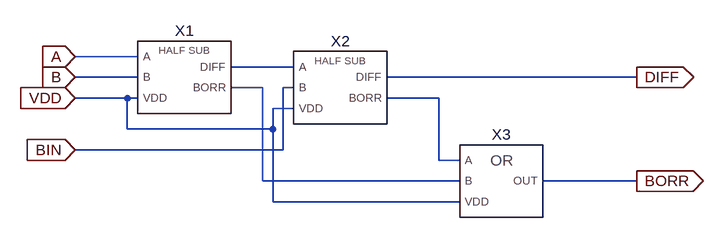
[diagram p0: schematic FullSubCMOS.asc]
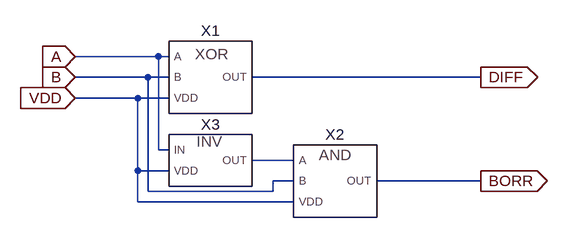
[diagram p1: sub-circuit halfsubcmos.asc]
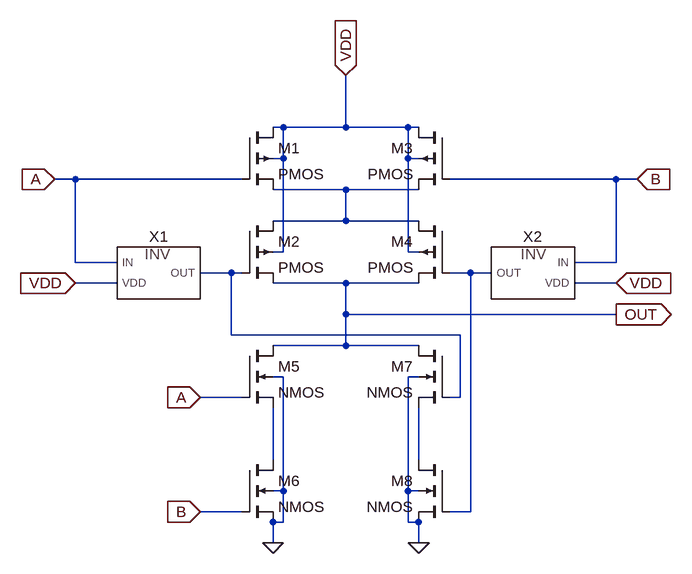
[diagram p2: sub-circuit xorcmos.asc]
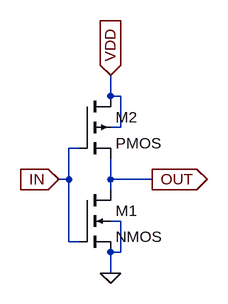
[diagram p3: sub-circuit invcmos.asc]
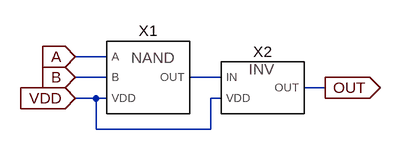
[diagram p4: sub-circuit andcmos.asc]
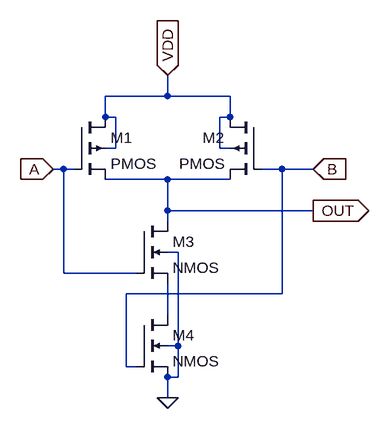
[diagram p5: sub-circuit nandcmos.asc]
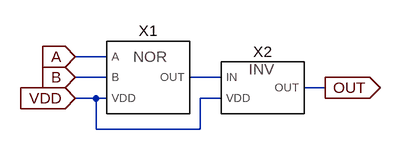
[diagram p6: sub-circuit orcmos.asc]
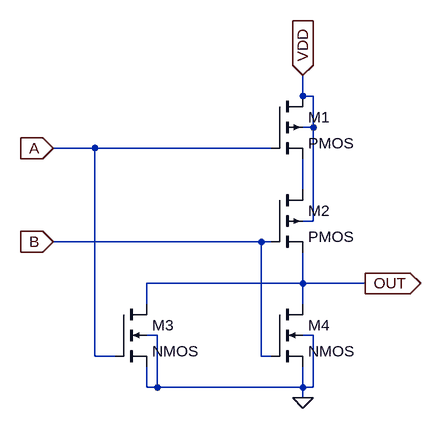
[diagram p7: sub-circuit norcmos.asc]
FullSubCMOS.asc, the LTspice schematic file:
Version 4
SHEET 1 1008 680
WIRE 112 112 16 112
WIRE 352 128 256 128
WIRE 112 144 16 144
WIRE 880 144 496 144
WIRE 304 160 256 160
WIRE 352 160 336 160
WIRE 96 176 16 176
WIRE 112 176 96 176
WIRE 576 176 496 176
WIRE 352 192 320 192
WIRE 96 224 96 176
WIRE 320 224 320 192
WIRE 320 224 96 224
WIRE 336 256 336 160
WIRE 336 256 16 256
WIRE 576 272 576 176
WIRE 608 272 576 272
WIRE 304 304 304 160
WIRE 608 304 304 304
WIRE 880 304 736 304
WIRE 320 336 320 224
WIRE 608 336 320 336
FLAG 16 112 A
IOPIN 16 112 In
FLAG 16 144 B
IOPIN 16 144 In
FLAG 16 176 VDD
IOPIN 16 176 In
FLAG 880 144 DIFF
IOPIN 880 144 Out
FLAG 880 304 BORR
IOPIN 880 304 Out
FLAG 16 256 BIN
IOPIN 16 256 In
SYMBOL HalfSubCMOS 176 144 R0
SYMATTR InstName X1
SYMBOL HalfSubCMOS 416 160 R0
SYMATTR InstName X2
SYMBOL OrCMOS 672 304 R0
SYMATTR InstName X3

halfsubcmos.asc, the sub-circuit schematic file:
Version 4
SHEET 1 880 680
WIRE 144 80 16 80
WIRE 160 80 144 80
WIRE 128 112 16 112
WIRE 160 112 128 112
WIRE 640 112 288 112
WIRE 112 144 16 144
WIRE 160 144 112 144
WIRE 144 224 144 80
WIRE 160 224 144 224
WIRE 352 240 288 240
WIRE 112 256 112 144
WIRE 160 256 112 256
WIRE 352 272 320 272
WIRE 640 272 480 272
WIRE 128 288 128 112
WIRE 320 288 320 272
WIRE 320 288 128 288
WIRE 112 304 112 256
WIRE 352 304 112 304
FLAG 16 80 A
IOPIN 16 80 In
FLAG 16 112 B
IOPIN 16 112 In
FLAG 16 144 VDD
IOPIN 16 144 In
FLAG 640 112 DIFF
IOPIN 640 112 Out
FLAG 640 272 BORR
IOPIN 640 272 Out
SYMBOL XorCMOS 224 112 R0
SYMATTR InstName X1
SYMBOL AndCMOS 416 272 R0
SYMATTR InstName X2
SYMBOL InvCMOS 224 240 R0
SYMATTR InstName X3

xorcmos.asc, the sub-circuit schematic file:
Version 4
SHEET 1 880 720
WIRE 160 32 144 32
WIRE 256 32 256 -48
WIRE 256 32 160 32
WIRE 352 32 256 32
WIRE 368 32 352 32
WIRE 160 80 160 32
WIRE 160 80 144 80
WIRE 352 80 352 32
WIRE 368 80 352 80
WIRE -160 112 -192 112
WIRE 96 112 -160 112
WIRE 672 112 416 112
WIRE 704 112 672 112
WIRE 256 128 144 128
WIRE 368 128 256 128
WIRE 256 176 256 128
WIRE 256 176 144 176
WIRE 368 176 256 176
WIRE 160 224 160 80
WIRE 160 224 144 224
WIRE 352 224 352 80
WIRE 368 224 352 224
WIRE -160 240 -160 112
WIRE -96 240 -160 240
WIRE 672 240 672 112
WIRE 672 240 608 240
WIRE 80 256 32 256
WIRE 96 256 80 256
WIRE 448 256 416 256
WIRE 480 256 448 256
WIRE -96 272 -160 272
WIRE 256 272 144 272
WIRE 368 272 256 272
WIRE 672 272 608 272
WIRE 256 320 256 272
WIRE 672 320 256 320
WIRE 80 352 80 256
WIRE 432 352 80 352
WIRE 256 368 256 320
WIRE 256 368 144 368
WIRE 368 368 256 368
WIRE 160 416 144 416
WIRE 368 416 352 416
WIRE 96 448 32 448
WIRE 432 448 432 352
WIRE 432 448 416 448
WIRE 144 544 144 464
WIRE 368 544 368 464
WIRE 160 592 160 416
WIRE 160 592 144 592
WIRE 352 592 352 416
WIRE 368 592 352 592
WIRE 96 624 32 624
WIRE 448 624 448 256
WIRE 448 624 416 624
WIRE 160 640 160 592
WIRE 160 640 144 640
WIRE 352 640 352 592
WIRE 368 640 352 640
WIRE 144 672 144 640
WIRE 368 672 368 640
FLAG 144 672 0
FLAG 368 672 0
FLAG -192 112 A
IOPIN -192 112 In
FLAG 704 112 B
IOPIN 704 112 In
FLAG 256 -48 VDD
IOPIN 256 -48 In
FLAG -160 272 VDD
IOPIN -160 272 In
FLAG 672 272 VDD
IOPIN 672 272 In
FLAG 32 448 A
IOPIN 32 448 In
FLAG 32 624 B
IOPIN 32 624 In
FLAG 672 320 OUT
IOPIN 672 320 Out
SYMBOL pmos4 96 32 R0
SYMATTR InstName M1
SYMATTR Value2 l=65nm w=162.5nm
SYMBOL pmos4 96 176 R0
SYMATTR InstName M2
SYMATTR Value2 l=65nm w=162.5nm
SYMBOL pmos4 416 32 M0
SYMATTR InstName M3
SYMATTR Value2 l=65nm w=162.5nm
SYMBOL pmos4 416 176 M0
SYMATTR InstName M4
SYMATTR Value2 l=65nm w=162.5nm
SYMBOL nmos4 96 368 R0
SYMATTR InstName M5
SYMATTR Value2 l=65nm w=65nm
SYMBOL nmos4 96 544 R0
SYMATTR InstName M6
SYMATTR Value2 l=65nm w=65nm
SYMBOL nmos4 416 368 M0
SYMATTR InstName M7
SYMATTR Value2 l=65nm w=65nm
SYMBOL nmos4 416 544 M0
SYMATTR InstName M8
SYMATTR Value2 l=65nm w=65nm
SYMBOL InvCMOS -32 256 R0
SYMATTR InstName X1
SYMBOL InvCMOS 544 256 M0
SYMATTR InstName X2

invcmos.asc, the sub-circuit schematic file:
Version 4
SHEET 1 880 680
WIRE 208 32 208 0
WIRE 224 32 208 32
WIRE 224 80 224 32
WIRE 224 80 208 80
WIRE 160 112 144 112
WIRE 144 160 144 112
WIRE 144 160 128 160
WIRE 208 160 208 128
WIRE 272 160 208 160
WIRE 208 176 208 160
WIRE 224 224 208 224
WIRE 144 256 144 160
WIRE 160 256 144 256
WIRE 224 272 224 224
WIRE 224 272 208 272
WIRE 208 304 208 272
FLAG 208 304 0
FLAG 208 0 VDD
IOPIN 208 0 In
FLAG 128 160 IN
IOPIN 128 160 In
FLAG 272 160 OUT
IOPIN 272 160 Out
SYMBOL nmos4 160 176 R0
SYMATTR InstName M1
SYMATTR Value2 l=65nm w=65nm
SYMBOL pmos4 160 32 R0
SYMATTR InstName M2
SYMATTR Value2 l=65nm w=162.5nm

andcmos.asc, the sub-circuit schematic file:
Version 4
SHEET 1 880 680
WIRE 112 112 64 112
WIRE 112 144 64 144
WIRE 288 144 240 144
WIRE 448 160 416 160
WIRE 96 176 64 176
WIRE 112 176 96 176
WIRE 288 176 272 176
WIRE 96 224 96 176
WIRE 272 224 272 176
WIRE 272 224 96 224
FLAG 64 112 A
IOPIN 64 112 In
FLAG 64 144 B
IOPIN 64 144 In
FLAG 64 176 VDD
IOPIN 64 176 In
FLAG 448 160 OUT
IOPIN 448 160 Out
SYMBOL NandCMOS 176 144 R0
SYMATTR InstName X1
SYMBOL InvCMOS 352 160 R0
SYMATTR InstName X2

nandcmos.asc, the sub-circuit schematic file:
Version 4
SHEET 1 880 680
WIRE -112 -160 -112 -192
WIRE -112 -160 -208 -160
WIRE -16 -160 -112 -160
WIRE -208 -128 -208 -160
WIRE -192 -128 -208 -128
WIRE -16 -128 -16 -160
WIRE -16 -128 -32 -128
WIRE -192 -80 -192 -128
WIRE -192 -80 -208 -80
WIRE -32 -80 -32 -128
WIRE -16 -80 -32 -80
WIRE -272 -48 -288 -48
WIRE -256 -48 -272 -48
WIRE 64 -48 32 -48
WIRE 112 -48 64 -48
WIRE -112 -32 -208 -32
WIRE -16 -32 -112 -32
WIRE -112 16 -112 -32
WIRE 112 16 -112 16
WIRE -112 32 -112 16
WIRE -96 80 -112 80
WIRE -272 112 -272 -48
WIRE -160 112 -272 112
WIRE 64 144 64 -48
WIRE 64 144 -176 144
WIRE -112 176 -112 128
WIRE -96 224 -96 80
WIRE -96 224 -112 224
WIRE -176 256 -176 144
WIRE -160 256 -176 256
WIRE -96 272 -96 224
WIRE -96 272 -112 272
WIRE -112 304 -112 272
FLAG -112 304 0
FLAG -112 -192 VDD
IOPIN -112 -192 In
FLAG -288 -48 A
IOPIN -288 -48 In
FLAG 112 -48 B
IOPIN 112 -48 In
FLAG 112 16 OUT
IOPIN 112 16 Out
SYMBOL pmos4 -256 -128 R0
SYMATTR InstName M1
SYMATTR Value2 l=65nm w=162.5nm
SYMBOL pmos4 32 -128 M0
SYMATTR InstName M2
SYMATTR Value2 l=65nm w=162.5nm
SYMBOL nmos4 -160 32 R0
SYMATTR InstName M3
SYMATTR Value2 l=65nm w=65nm
SYMBOL nmos4 -160 176 R0
SYMATTR InstName M4
SYMATTR Value2 l=65nm w=65nm

orcmos.asc, the sub-circuit schematic file:
Version 4
SHEET 1 880 680
WIRE 112 128 64 128
WIRE 112 160 64 160
WIRE 288 160 240 160
WIRE 448 176 416 176
WIRE 96 192 64 192
WIRE 112 192 96 192
WIRE 288 192 256 192
WIRE 96 240 96 192
WIRE 256 240 256 192
WIRE 256 240 96 240
FLAG 64 128 A
IOPIN 64 128 In
FLAG 64 160 B
IOPIN 64 160 In
FLAG 64 192 VDD
IOPIN 64 192 In
FLAG 448 176 OUT
IOPIN 448 176 Out
SYMBOL NorCMOS 176 160 R0
SYMATTR InstName X1
SYMBOL InvCMOS 352 176 R0
SYMATTR InstName X2

norcmos.asc, the sub-circuit schematic file:
Version 4
SHEET 1 880 680
WIRE 224 16 224 -16
WIRE 240 16 224 16
WIRE 240 64 240 16
WIRE 240 64 224 64
WIRE -96 96 -160 96
WIRE 176 96 -96 96
WIRE 224 160 224 112
WIRE 240 208 240 64
WIRE 240 208 224 208
WIRE 160 240 -160 240
WIRE 176 240 160 240
WIRE 224 304 224 256
WIRE 224 304 -16 304
WIRE 320 304 224 304
WIRE -16 336 -16 304
WIRE 224 336 224 304
WIRE 0 384 -16 384
WIRE 240 384 224 384
WIRE -96 416 -96 96
WIRE -64 416 -96 416
WIRE 160 416 160 240
WIRE 176 416 160 416
WIRE -16 464 -16 432
WIRE 0 464 0 384
WIRE 0 464 -16 464
WIRE 224 464 224 432
WIRE 224 464 0 464
WIRE 240 464 240 384
WIRE 240 464 224 464
WIRE 224 480 224 464
FLAG 224 480 0
FLAG 224 -16 VDD
IOPIN 224 -16 In
FLAG -160 96 A
IOPIN -160 96 In
FLAG -160 240 B
IOPIN -160 240 In
FLAG 320 304 OUT
IOPIN 320 304 Out
SYMBOL pmos4 176 16 R0
SYMATTR InstName M1
SYMATTR Value2 l=65nm w=162.5nm
SYMBOL pmos4 176 160 R0
SYMATTR InstName M2
SYMATTR Value2 l=65nm w=162.5nm
SYMBOL nmos4 -64 336 R0
SYMATTR InstName M3
SYMATTR Value2 l=65nm w=65nm
SYMBOL nmos4 176 336 R0
SYMATTR InstName M4
SYMATTR Value2 l=65nm w=65nm

The netlist it stands for:
* FullSubCMOS.asc
XX1 A B VDD N002 N001 halfsubcmos
XX2 N001 BIN VDD N003 DIFF halfsubcmos
XX3 N003 N002 VDD BORR orcmos

* block symbol definitions
.subckt halfsubcmos A B VDD BORR DIFF
XX1 A B VDD DIFF xorcmos
XX2 N001 B VDD BORR andcmos
XX3 A VDD N001 invcmos
.ends halfsubcmos

.subckt xorcmos A B VDD OUT
M1 VDD A N001 VDD PMOS l=65nm w=162.5nm
M2 N001 N002 OUT VDD PMOS l=65nm w=162.5nm
M3 VDD B N001 VDD PMOS l=65nm w=162.5nm
M4 N001 N003 OUT VDD PMOS l=65nm w=162.5nm
M5 OUT A N004 0 NMOS l=65nm w=65nm
M6 N004 B 0 0 NMOS l=65nm w=65nm
M7 OUT N002 N005 0 NMOS l=65nm w=65nm
M8 N005 N003 0 0 NMOS l=65nm w=65nm
XX1 A VDD N002 invcmos
XX2 B VDD N003 invcmos
.ends xorcmos

.subckt invcmos IN VDD OUT
M1 OUT IN 0 0 NMOS l=65nm w=65nm
M2 VDD IN OUT VDD PMOS l=65nm w=162.5nm
.ends invcmos

.subckt andcmos A B VDD OUT
XX1 A B VDD N001 nandcmos
XX2 N001 VDD OUT invcmos
.ends andcmos

.subckt nandcmos A B VDD OUT
M1 VDD A OUT VDD PMOS l=65nm w=162.5nm
M2 VDD B OUT VDD PMOS l=65nm w=162.5nm
M3 OUT A N001 0 NMOS l=65nm w=65nm
M4 N001 B 0 0 NMOS l=65nm w=65nm
.ends nandcmos

.subckt orcmos A B VDD OUT
XX1 A B VDD N001 norcmos
XX2 N001 VDD OUT invcmos
.ends orcmos

.subckt norcmos A B VDD OUT
M1 VDD A N001 VDD PMOS l=65nm w=162.5nm
M2 N001 B OUT VDD PMOS l=65nm w=162.5nm
M3 OUT A 0 0 NMOS l=65nm w=65nm
M4 OUT B 0 0 NMOS l=65nm w=65nm
.ends norcmos

.model NMOS NMOS
.model PMOS PMOS
.lib standard.mos
.backanno
.end